# EAGLE design lorelei_A_v1 (EAGLE 9.6.2)
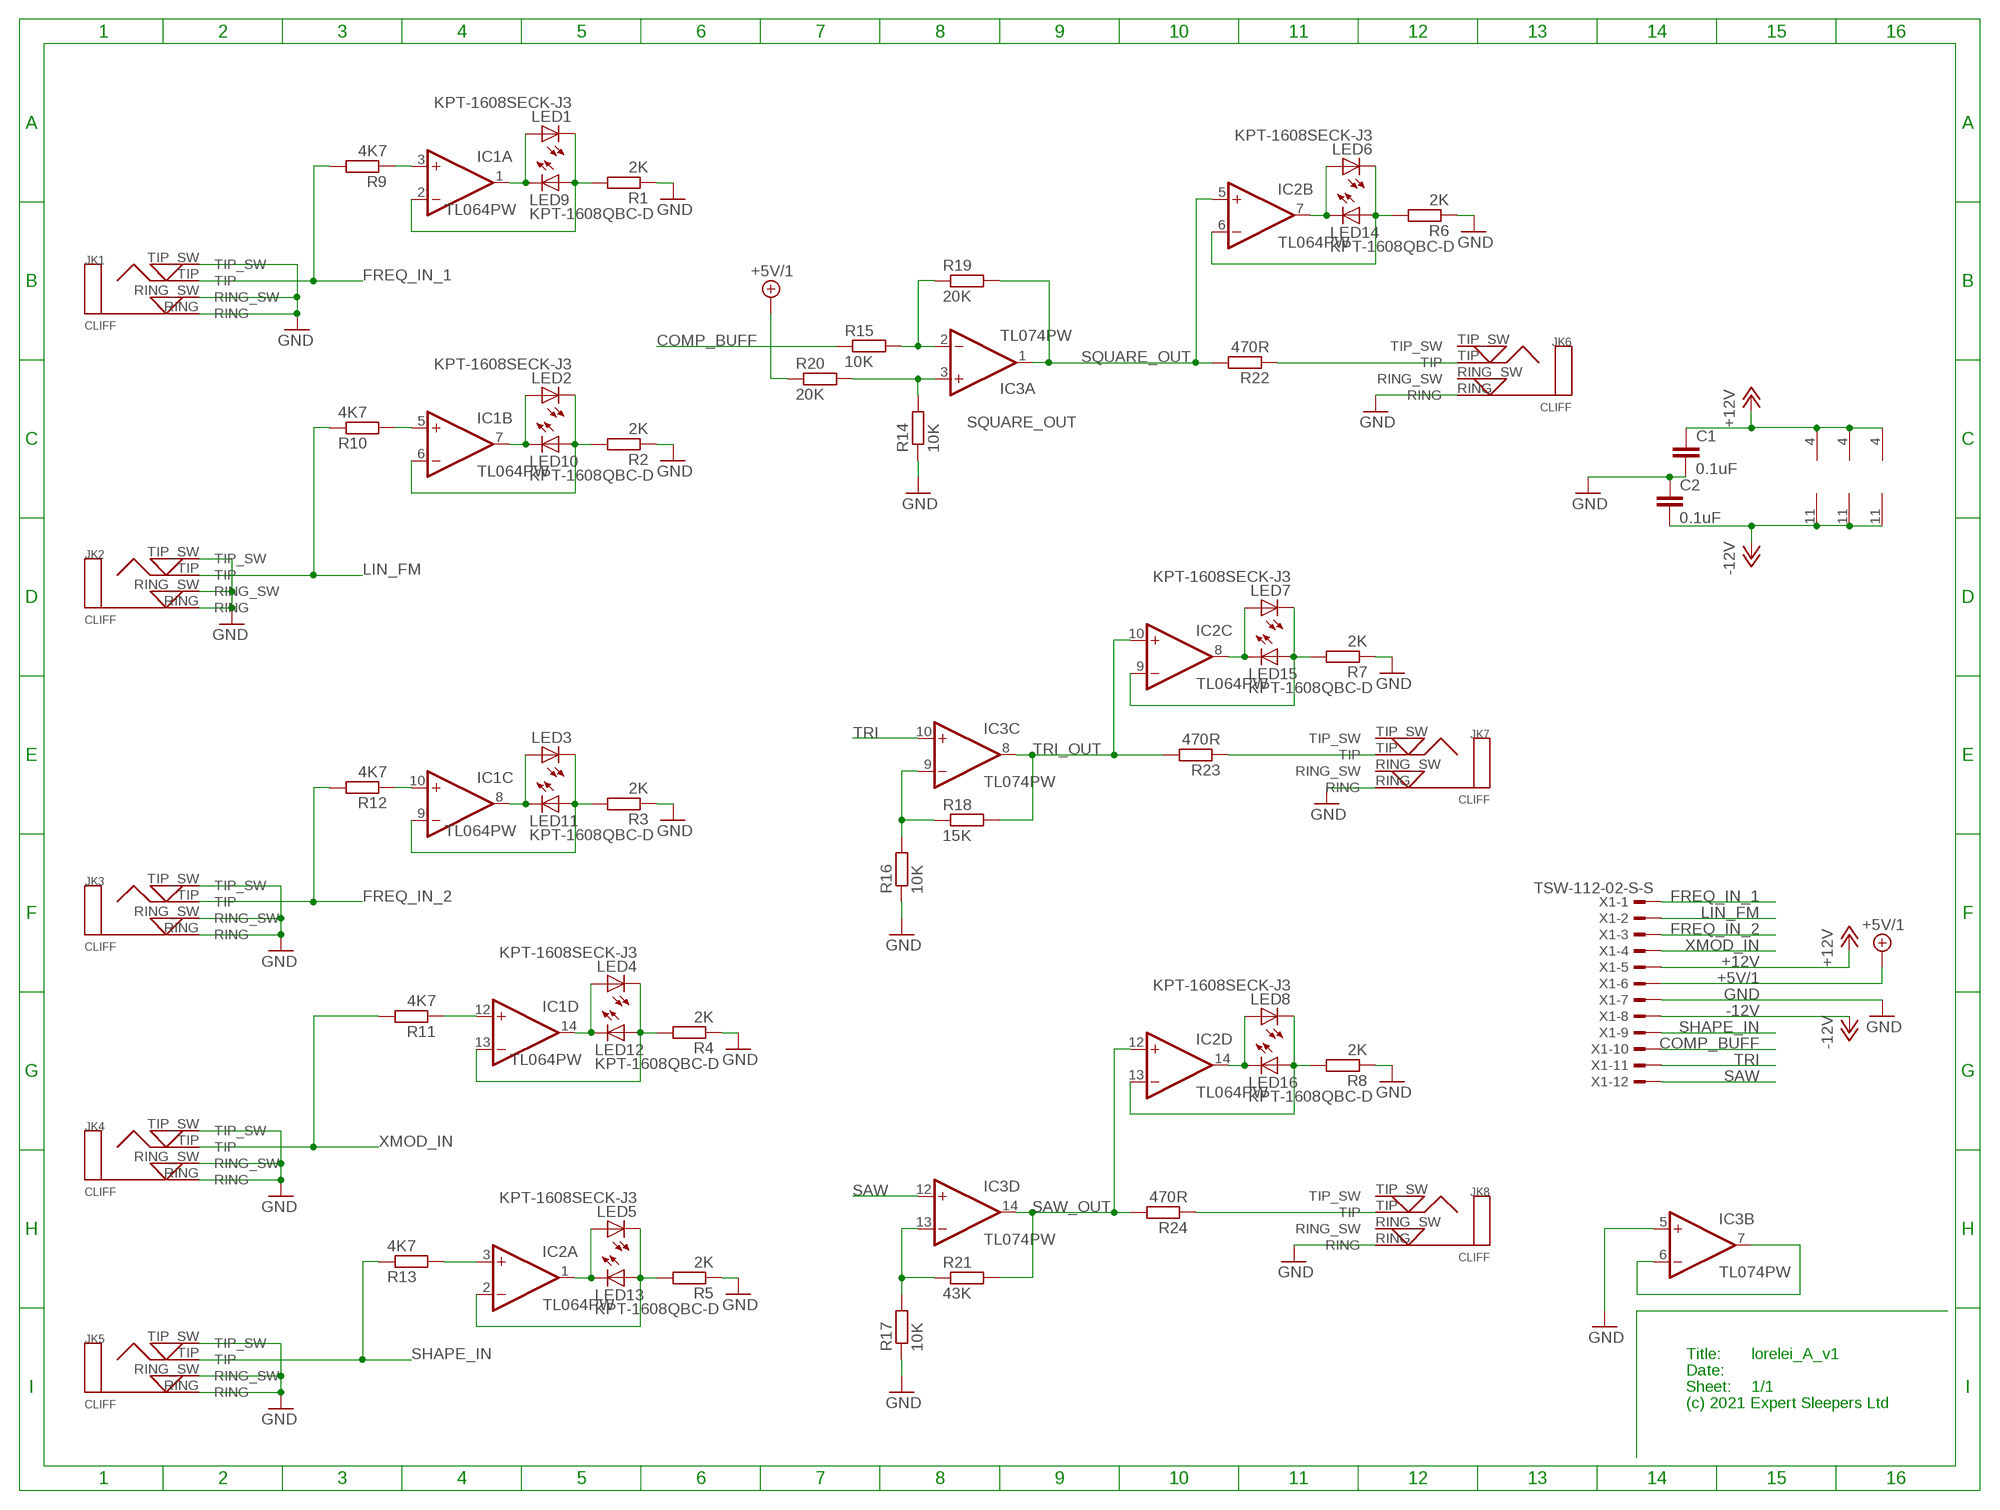
[diagram p0: schematic, sheet 1]

## Parts
C1  0.1uF  C-EUC0402  [C0402]
C2  0.1uF  C-EUC0402  [C0402]
IC1  TL064PW  TL074PW  [PW_R-PDSO-G14]
IC2  TL064PW  TL074PW  [PW_R-PDSO-G14]
IC3  TL074PW  [PW_R-PDSO-G14]
JK1  CLIFF  CLIFF3.5MM_PCB_SW_JK  [CLIFF3.5MMPCB]
JK2  CLIFF  CLIFF3.5MM_PCB_SW_JK  [CLIFF3.5MMPCB]
JK3  CLIFF  CLIFF3.5MM_PCB_SW_JK  [CLIFF3.5MMPCB]
JK4  CLIFF  CLIFF3.5MM_PCB_SW_JK  [CLIFF3.5MMPCB]
JK5  CLIFF  CLIFF3.5MM_PCB_SW_JK  [CLIFF3.5MMPCB]
JK6  CLIFF  CLIFF3.5MM_PCB_SW_JK  [CLIFF3.5MMPCB]
JK7  CLIFF  CLIFF3.5MM_PCB_SW_JK  [CLIFF3.5MMPCB]
JK8  CLIFF  CLIFF3.5MM_PCB_SW_JK  [CLIFF3.5MMPCB]
LED1  KPT-1608SECK-J3  [CHIPLED_0603_LEFT]
LED2  KPT-1608SECK-J3  [CHIPLED_0603_LEFT]
LED3  KPT-1608SECK-J3  [CHIPLED_0603_LEFT]
LED4  KPT-1608SECK-J3  [CHIPLED_0603_LEFT]
LED5  KPT-1608SECK-J3  [CHIPLED_0603_LEFT]
LED6  KPT-1608SECK-J3  [CHIPLED_0603_LEFT]
LED7  KPT-1608SECK-J3  [CHIPLED_0603_LEFT]
LED8  KPT-1608SECK-J3  [CHIPLED_0603_LEFT]
LED9  KPT-1608QBC-D  [CHIPLED_0603_RIGHT]
LED10  KPT-1608QBC-D  [CHIPLED_0603_RIGHT]
LED11  KPT-1608QBC-D  [CHIPLED_0603_RIGHT]
LED12  KPT-1608QBC-D  [CHIPLED_0603_RIGHT]
LED13  KPT-1608QBC-D  [CHIPLED_0603_RIGHT]
LED14  KPT-1608QBC-D  [CHIPLED_0603_RIGHT]
LED15  KPT-1608QBC-D  [CHIPLED_0603_RIGHT]
LED16  KPT-1608QBC-D  [CHIPLED_0603_RIGHT]
R1  2K  R-EU_R1206  [R1206]
R2  2K  R-EU_R1206  [R1206]
R3  2K  R-EU_R1206  [R1206]
R4  2K  R-EU_R1206  [R1206]
R5  2K  R-EU_R1206  [R1206]
R6  2K  R-EU_R1206  [R1206]
R7  2K  R-EU_R1206  [R1206]
R8  2K  R-EU_R1206  [R1206]
R9  4K7  R-EU_R1206  [R1206]
R10  4K7  R-EU_R1206  [R1206]
R11  4K7  R-EU_R1206  [R1206]
R12  4K7  R-EU_R1206  [R1206]
R13  4K7  R-EU_R1206  [R1206]
R14  10K  R-EU_R0603  [R0603]
R15  10K  R-EU_R0603  [R0603]
R16  10K  R-EU_R0603  [R0603]
R17  10K  R-EU_R0603  [R0603]
R18  15K  R-EU_R0603  [R0603]
R19  20K  R-EU_R0603  [R0603]
R20  20K  R-EU_R0603  [R0603]
R21  43K  R-EU_R0603  [R0603]
R22  470R  R-EU_R1206  [R1206]
R23  470R  R-EU_R1206  [R1206]
R24  470R  R-EU_R1206  [R1206]
X1  TSW-112-02-S-S  [TSW-112-02-S-S]

## Nets
+5V/1: R20.1 X1.6
+12V: C1.1 IC1.4(P:V+) IC2.4(P:V+) IC3.4(P:V+) X1.5
-12V: C2.2 IC1.11(P:V-) IC2.11(P:V-) IC3.11(P:V-) X1.8
COMP_BUFF: R15.1 X1.10
FREQ_IN_1: JK1.TIP R9.2 X1.1
FREQ_IN_2: JK3.TIP R12.2 X1.3
GND [power]: C1.2 C2.1 IC3.5(B:+IN) JK1.RING JK1.RING_SW JK1.TIP_SW JK2.RING JK2.RING_SW JK2.TIP_SW JK3.RING JK3.RING_SW JK3.TIP_SW JK4.RING JK4.RING_SW JK4.TIP_SW JK5.RING JK5.RING_SW JK5.TIP_SW JK6.RING JK7.RING JK8.RING R1.1 R2.1 R3.1 R4.1 R5.1 R6.1 R7.1 R8.1 R14.1 R16.1 R17.1 X1.7
LIN_FM: JK2.TIP R10.1 X1.2
N$3: IC3.6(B:-IN) IC3.7(B:OUT)
N$5: IC3.3(A:+IN) R14.2 R20.2
N$7: IC3.2(A:-IN) R15.2 R19.1
N$18: IC3.9(C:-IN) R16.2 R18.1
N$22: IC3.13(D:-IN) R17.2 R21.1
N$24: JK7.TIP R23.1
N$25: IC1.12(D:+IN) R11.1
N$41: IC1.14(D:OUT) LED4.2(A) LED12.2(C)
N$42: IC1.13(D:-IN) LED4.1(C) LED12.1(A) R4.2
N$43: IC1.1(A:OUT) LED1.2(A) LED9.2(C)
N$44: IC1.2(A:-IN) LED1.1(C) LED9.1(A) R1.2
N$47: IC2.3(A:+IN) R13.2
N$49: IC1.8(C:OUT) LED3.2(A) LED11.2(C)
N$50: IC1.9(C:-IN) LED3.1(C) LED11.1(A) R3.2
N$51: IC1.3(A:+IN) R9.1
N$52: IC1.10(C:+IN) R12.1
N$55: IC1.7(B:OUT) LED2.2(A) LED10.2(C)
N$56: IC1.6(B:-IN) LED2.1(C) LED10.1(A) R2.2
N$58: IC2.7(B:OUT) LED6.2(A) LED14.2(C)
N$60: IC2.6(B:-IN) LED6.1(C) LED14.1(A) R6.2
N$61: JK6.TIP R22.1
N$62: IC2.8(C:OUT) LED7.2(A) LED15.2(C)
N$63: IC2.9(C:-IN) LED7.1(C) LED15.1(A) R7.2
N$65: IC2.14(D:OUT) LED8.2(A) LED16.2(C)
N$66: IC2.13(D:-IN) LED8.1(C) LED16.1(A) R8.2
N$71: IC2.1(A:OUT) LED5.2(A) LED13.2(C)
N$72: IC2.2(A:-IN) LED5.1(C) LED13.1(A) R5.2
N$76: JK8.TIP R24.1
OUT_TO_FB1: IC1.5(B:+IN) R10.2
SAW: IC3.12(D:+IN) X1.12
SAW_OUT: IC2.12(D:+IN) IC3.14(D:OUT) R21.2 R24.2
SHAPE_IN: JK5.TIP R13.1 X1.9
SQUARE_OUT: IC2.5(B:+IN) IC3.1(A:OUT) R19.2 R22.2
TRI: IC3.10(C:+IN) X1.11
TRI_OUT: IC2.10(C:+IN) IC3.8(C:OUT) R18.2 R23.2
XMOD_IN: JK4.TIP R11.2 X1.4
Unconnected: JK6.RING_SW JK6.TIP_SW JK7.RING_SW JK7.TIP_SW JK8.RING_SW JK8.TIP_SW

## Notes on the sheet
- Title:
- Date:
- Sheet:
- (c) 2021 Expert Sleepers Ltd

## Library data of the parts
C1 C2 = rcl:C-EU: CAPACITOR, European symbol
IC1-IC3 = digital-audio:TL074: OP AMP
JK1-JK8 = cliff:CLIFF3.5MM_PCB_SW_JK: Cliff 3.5mm Mono PCB switched jack socket
LED1-LED8 = kingbright:KPT-1608SECK-J3
LED9-LED16 = kingbright:KPT-1608QBC-D
R1-R24 = rcl:R-EU_: RESISTOR, European symbol
X1 = con-samtec:TSW-112-02-S-S: THROUGH-HOLE .025" SQ POST HEADER Source: Samtec TSW.pdf; OC_FARNELL: unknown; OC_NEWARK: unknown

## Board
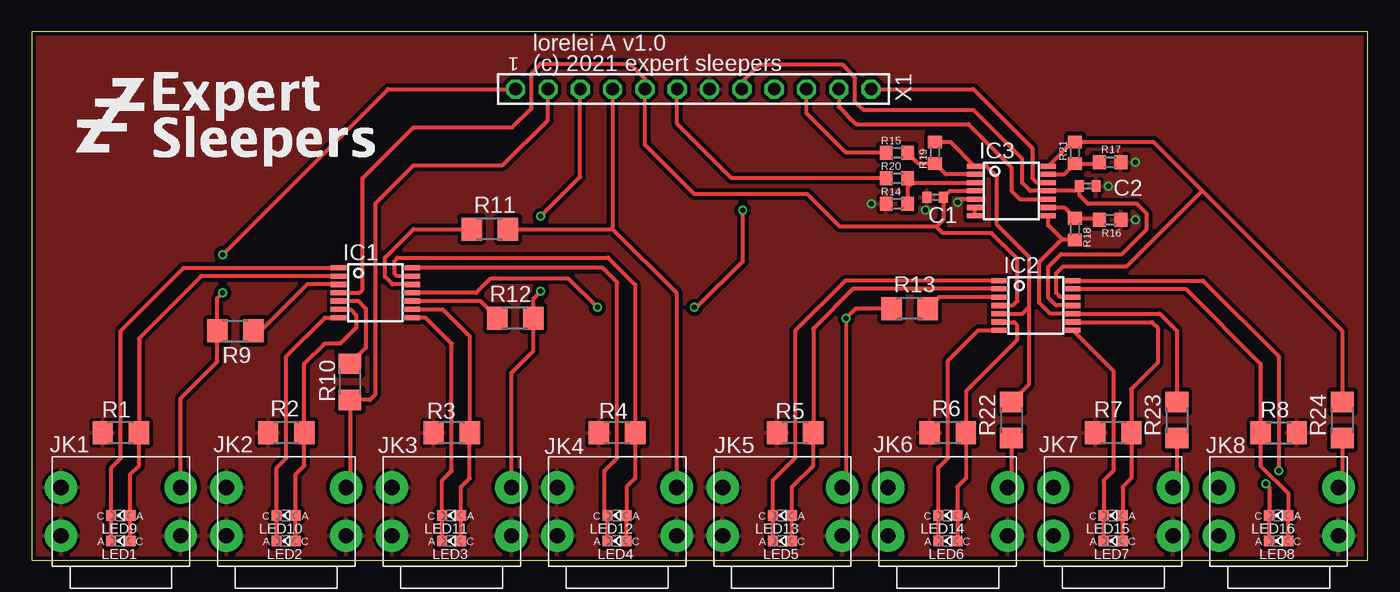
[diagram p1: board, top side]
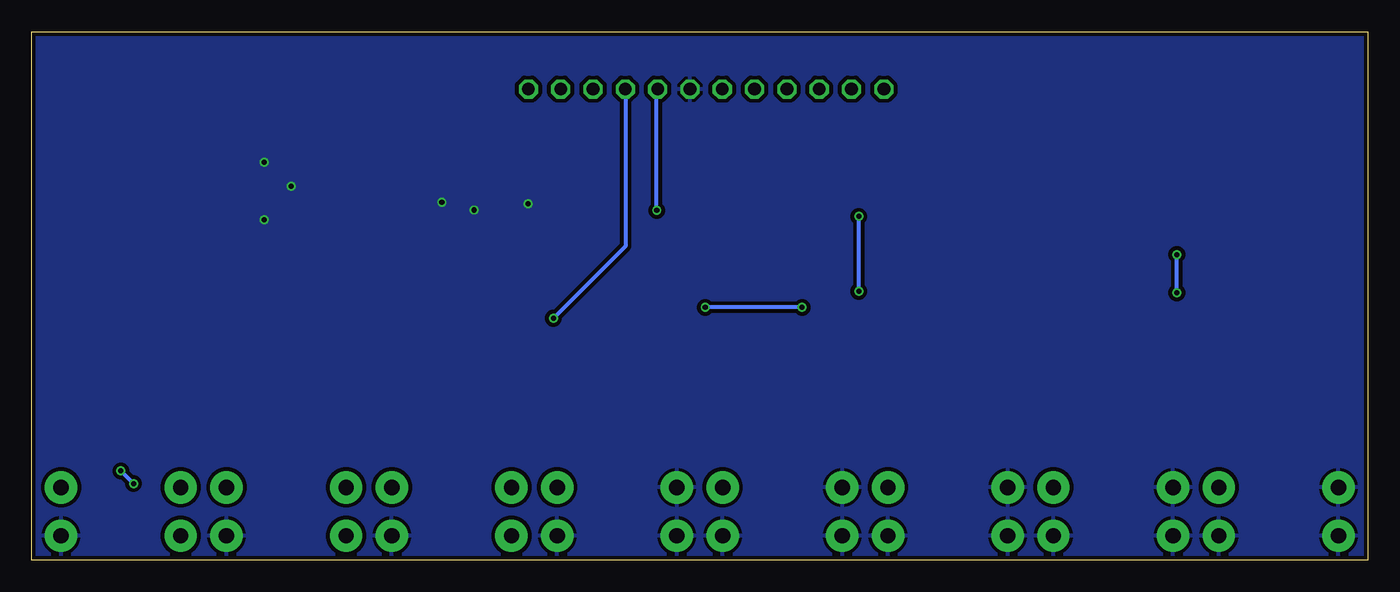
[diagram p2: board, bottom side, seen from below]

Size 105 x 41.5 mm. Coordinates in mm from the lower left corner, seen from the top.
Outline: 0,0 105,0 105,41.5 0,41.5 0,0
Copper layers (1*16): Top 0.035mm / dielectric 1.5mm / Bottom 0.035mm
Design rules "pcbtrain *": minimum track width 0.125mm, minimum drill 0.3mm, track to track 0.125mm, track to pad 0.125mm, pad to pad 0.125mm, via to via 0.125mm, smd to smd 0.125mm, copper to edge 0.25mm, drill to drill 8mil, minimum pad ring 0.15mm, minimum via ring 0.15mm, stop-mask expansion 4mil, vias tented up to drill 0mil, thermal gap 10mil

### Footprints (pad centres in the part's own frame; a part is rotated, then mirrored left to right if it is on the bottom)
C0402 = smd 0.7 x 0.9: 1 -0.65,0; 2 0.65,0
PW_R-PDSO-G14 = smd 0.4 x 1.2: 1 -1.95,-2.9; 2 -1.3,-2.9; 3 -0.65,-2.9; 4 0,-2.9; 5 0.65,-2.9; 6 1.3,-2.9; 7 1.95,-2.9; 8 1.95,2.9; 9 1.3,2.9; 10 0.65,2.9; 11 0,2.9; 12 -0.65,2.9; 13 -1.3,2.9; 14 -1.95,2.9
CLIFF3.5MMPCB = drill 1.2 pad 2.54: RING 4.7,-1.9; RING_SW -4.7,-1.9; TIP 4.7,1.9; TIP_SW -4.7,1.9
CHIPLED_0603_LEFT = smd 0.8 x 0.8: 1 0,-0.75; 2 0,0.75
CHIPLED_0603_RIGHT = smd 0.8 x 0.8: 1 0,-0.75; 2 0,0.75
R1206 = smd 1.6 x 1.803: 1 -1.422,0; 2 1.422,0
R0603 = smd 1 x 1.1: 1 -0.85,0; 2 0.85,0
TSW-112-02-S-S = drill 1 pad 1.5 octagon: 1 13.97,0; 2 11.43,0; 3 8.89,0; 4 6.35,0; 5 3.81,0; 6 1.27,0; 7 -1.27,0; 8 -3.81,0; 9 -6.35,0; 10 -8.89,0; 11 -11.43,0; 12 -13.97,0

### Placement (x,y rotation side)
C1  71,28.5 180 top
C2  83,29.38 180 top
IC1  27,21 270 top
IC2  78.92,20 270 top
IC3  77,29 270 top
JK1  7,3.8 0 top
JK2  20,3.8 0 top
JK3  33,3.8 0 top
JK4  46,3.8 0 top
JK5  59,3.8 0 top
JK6  72,3.8 0 top
JK7  85,3.8 0 top
JK8  98,3.8 0 top
LED1  7,1.5 90 top
LED2  20,1.5 90 top
LED3  33,1.5 90 top
LED4  46,1.5 90 top
LED5  59,1.5 90 top
LED6  72,1.5 90 top
LED7  85,1.5 90 top
LED8  98,1.5 90 top
LED9  7,3.5 90 top
LED10  20,3.5 90 top
LED11  33,3.5 90 top
LED12  46,3.5 90 top
LED13  59,3.5 90 top
LED14  72,3.5 90 top
LED15  85,3.5 90 top
LED16  98,3.5 90 top
R1  7,10 0 top
R2  20,10 0 top
R3  33,10 0 top
R4  46,10 0 top
R5  60,10 0 top
R6  72,10 0 top
R7  85,10 0 top
R8  98,10 180 top
R9  16,18 180 top
R10  25,14 90 top
R11  36,26 0 top
R12  38,19 0 top
R13  69,19.75 0 top
R14  68,28 0 top
R15  68,32 0 top
R16  84.75,26.75 180 top
R17  84.75,31.25 180 top
R18  82,26 270 top
R19  71,32 90 top
R20  68,30 0 top
R21  82,32 90 top
R22  77,11 90 top
R23  90,11 90 top
R24  103,11 90 top
U$1  [ES_ZZZ_TEXT_TPLACE_1IN_600DPI]  2.54,30.48 0 top
X1  52,37 180 top

### Tracks (layer width: path | path; a pad name or v marks a point on that pad's centre or on a via)
+5V/1
  Top 0.305: R20.1 55,30 50.73,34.27 X1.6
+12V
  Top 0.305: IC3.4 72.15,29 C1.1 71.65,26.73 71.12,26.2 | IC1.4 25.75,21 26,21.25 26,30 30,34 37.75,34 39.3,35.5 39.3,38.25 40,39 47,39 48.19,37.81 X1.5 48.19,32.62 52.07,28.74 60.96,28.74 63.5,26.2 71.12,26.2 | IC2.4 77.11,20 77.47,20.36 77.47,23.66 75.44,25.69 71.63,25.69 71.12,26.2
-12V  (via drill 0.4)
  Top 0.305: IC1.11 34.92,20.99 36.07,22.14 42.16,22.14 v44.45,19.85 | v52.07,19.85 52.26,19.85 55.88,23.47 v55.88,27.47 | X1.8 55.81,37.56 57.15,38.9 63.75,38.9 64.7,37.88 64.7,35.98 65.41,35.34 74.04,35.34 77.85,31.53 77.85,29.63 78.48,29 IC3.11 81.97,29 C2.2 82.35,28.65 83.02,27.98 86.87,27.98 87.63,27.22 87.63,26 85.68,24.04 80.9,24.04 79.88,23.02 79.88,20.61 80.5,20 IC2.11
  Bottom 0.305: v44.45,19.85 v52.07,19.85 | v55.88,27.47 55.88,36.93 X1.8
COMP_BUFF
  Top 0.305: R15.1 64,32 60.89,35.11 X1.10
FREQ_IN_1  (via drill 0.4)
  Top 0.305: JK1.TIP 11.7,12.7 14.58,15.58 R9.2 14.58,20.58 v15,21 | v15,24 28,37 X1.1
  Bottom 0.305: v15,21 v15,24
FREQ_IN_2  (via drill 0.4)
  Top 0.305: JK3.TIP 37.7,14.7 39.42,16.42 R12.2 39.42,20.53 v40,21.11 | X1.3 43.11,30.11 v40,27
  Bottom 0.305: v40,21.11 v40,27
GND  (via drill 0.4)
  Top 0.305: IC3.5 73.02,28.35 v72.77,28.11
  other vias: 70.25,27.5 84.62,29.38 66,28 86.75,26.75 86.75,31.25
  pour Top (isolate 0.305): 0,0 105,0 105,41.5 0,41.5
  pour Bottom (isolate 0.305): 0,0 105,0 105,41.5 0,41.5
LIN_FM
  Top 0.305: X1.2 40.57,34.57 37,31 30,31 27,28 27,13 26.58,12.58 R10.1 25,6 JK2.TIP
N$3
  Top 0.305: IC3.6 IC3.7
N$5
  Top 0.305: 69.2,29.65 IC3.3 | R20.2 69.2,29.65 | R14.2 68.85,29.3 69.2,29.65
N$7
  Top 0.305: IC3.2 71.85,30.3 R19.1 69.7,31.15 R15.2
N$18
  Top 0.305: IC3.9 81.15,27.7 R18.1 83.8,26.85 R16.2
N$22
  Top 0.305: IC3.13 81.15,30.3 R21.1 83.8,31.15 R17.2
N$24
  Top 0.305: R23.1 90,6 JK7.TIP
N$25
  Top 0.305: IC1.12 28.35,21.65 27.75,22.25 27.75,23.75 30,26 R11.1
N$41
  Top 0.305: LED4.2 LED12.2 45,3.75 45,7 46,8 46,21.81 44.86,22.95 IC1.14
N$42
  Top 0.305: IC1.13 28.7,22.3 28.5,22.5 28.5,23.5 28.75,23.75 45.31,23.75 47.42,21.64 R4.2 47.42,6.42 46.75,5.75 LED12.1 LED4.1
N$43
  Top 0.305: LED1.2 LED9.2 6.25,7.25 7,8 7,18 11.95,22.95 IC1.1
N$44
  Top 0.305: LED1.1 LED9.1 7.75,6.75 8.42,7.42 R1.2 8.42,17.42 13.3,22.3 IC1.2
N$47
  Top 0.305: IC2.3 71.32,20.65 R13.2
N$49
  Top 0.305: LED3.2 LED11.2 32.25,6.25 33,7 33,17 30.95,19.05 IC1.8
N$50
  Top 0.305: LED3.1 LED11.1 33.75,5.75 34.42,6.42 R3.2 34.42,17.58 32.3,19.7 IC1.9
N$51
  Top 0.305: IC1.3 21.65,21.65 18,18 R9.1
N$52
  Top 0.305: IC1.10 35.23,20.35 R12.1
N$55
  Top 0.305: LED2.2 LED10.2 19.25,7.25 20,8 20,16 23.05,19.05 IC1.7
N$56
  Top 0.305: LED2.1 LED10.1 20.75,6.75 21.42,7.42 R2.2 21.42,15.42 23,17 24.25,17 25.5,18.25 25.5,19.25 25.05,19.7 IC1.6
N$58
  Top 0.305: LED6.2 LED14.2 71.25,7.25 72.01,8.01 72.01,15.66 74.4,18.05 IC2.7
N$60
  Top 0.305: IC2.6 77.22,18.7 77.42,18.5 77.42,17.25 73.42,13.25 R6.2 73.42,6.42 72.75,5.75 LED14.1 LED6.1
N$61
  Top 0.305: R22.1 77,6 JK6.TIP
N$62
  Top 0.305: LED7.2 LED15.2 84.25,6.25 85,7 85,14.87 IC2.8
N$63
  Top 0.305: LED7.1 LED15.1 85.75,5.75 86.42,6.42 R7.2 86.42,13.42 88.5,15.5 88.5,18.25 88.05,18.7 IC2.9
N$65  (via drill 0.4)
  Top 0.305: LED8.2 LED16.2 97.25,5.75 v97,6 | IC2.14 92.05,21.95 98,16 v98,7
  Bottom 0.305: v98,7 v97,6
N$66
  Top 0.305: LED8.1 LED16.1 98.75,5.25 96.58,7.42 R8.2 96.58,15.42 90.7,21.3 IC2.13
N$71
  Top 0.305: LED5.2 LED13.2 58.25,6.25 60,8 60,18 63.95,21.95 IC2.1
N$72
  Top 0.305: LED5.1 LED13.1 59.75,5.75 61.42,7.42 R5.2 61.42,18.17 64.55,21.3 IC2.2
N$76
  Top 0.305: R24.1 103,6 JK8.TIP
OUT_TO_FB1
  Top 0.305: IC1.5 25.65,20.35 26.25,19.75 26.25,16.67 R10.2
SAW
  Top 0.305: X1.12 74,37 78.64,32.37 78.64,30 78.98,29.65 IC3.12
SAW_OUT
  Top 0.305: IC3.14 81.8,32.85 R21.2 88.15,32.85 92,29 | R24.2 103,18 92,29 | 92,29 86.07,23.07 81.07,23.07 80.52,22.52 80.52,20.99 80.86,20.65 IC2.12
SHAPE_IN  (via drill 0.4)
  Top 0.305: JK5.TIP 64,6 v64,19 64.75,19.75 R13.1
  Bottom 0.305: X1.9 58.35,24.65 v64,19
SQUARE_OUT
  Top 0.305: R19.2 72.2,32.85 IC3.1 75.05,30.95 75.87,30.13 75.87,26.33 78.36,23.84 78.36,19.85 | 78.36,19.85 77.86,19.35 IC2.5 | 78.36,19.85 78.36,13.78 R22.2
TRI
  Top 0.305: X1.11 63.43,35.6 64.8,34.24 73.62,34.24 77,30.86 77,29 77.65,28.35 IC3.10
TRI_OUT
  Top 0.305: IC3.8 79.9,26.29 81.04,25.15 R18.2 80.9,25.15 79.17,23.41 79.17,20.25 80.06,19.35 IC2.10 88.65,19.35 90,18 R23.2
XMOD_IN
  Top 0.305: R11.2 45.65,26 | X1.4 45.65,26 | 45.65,26 50.7,20.95 JK4.TIP

### Text on the board
tPlace: lorelei A v1.0 | (c) 2021 expert sleepers